# EAGLE design Board (EAGLE 6.5.0)
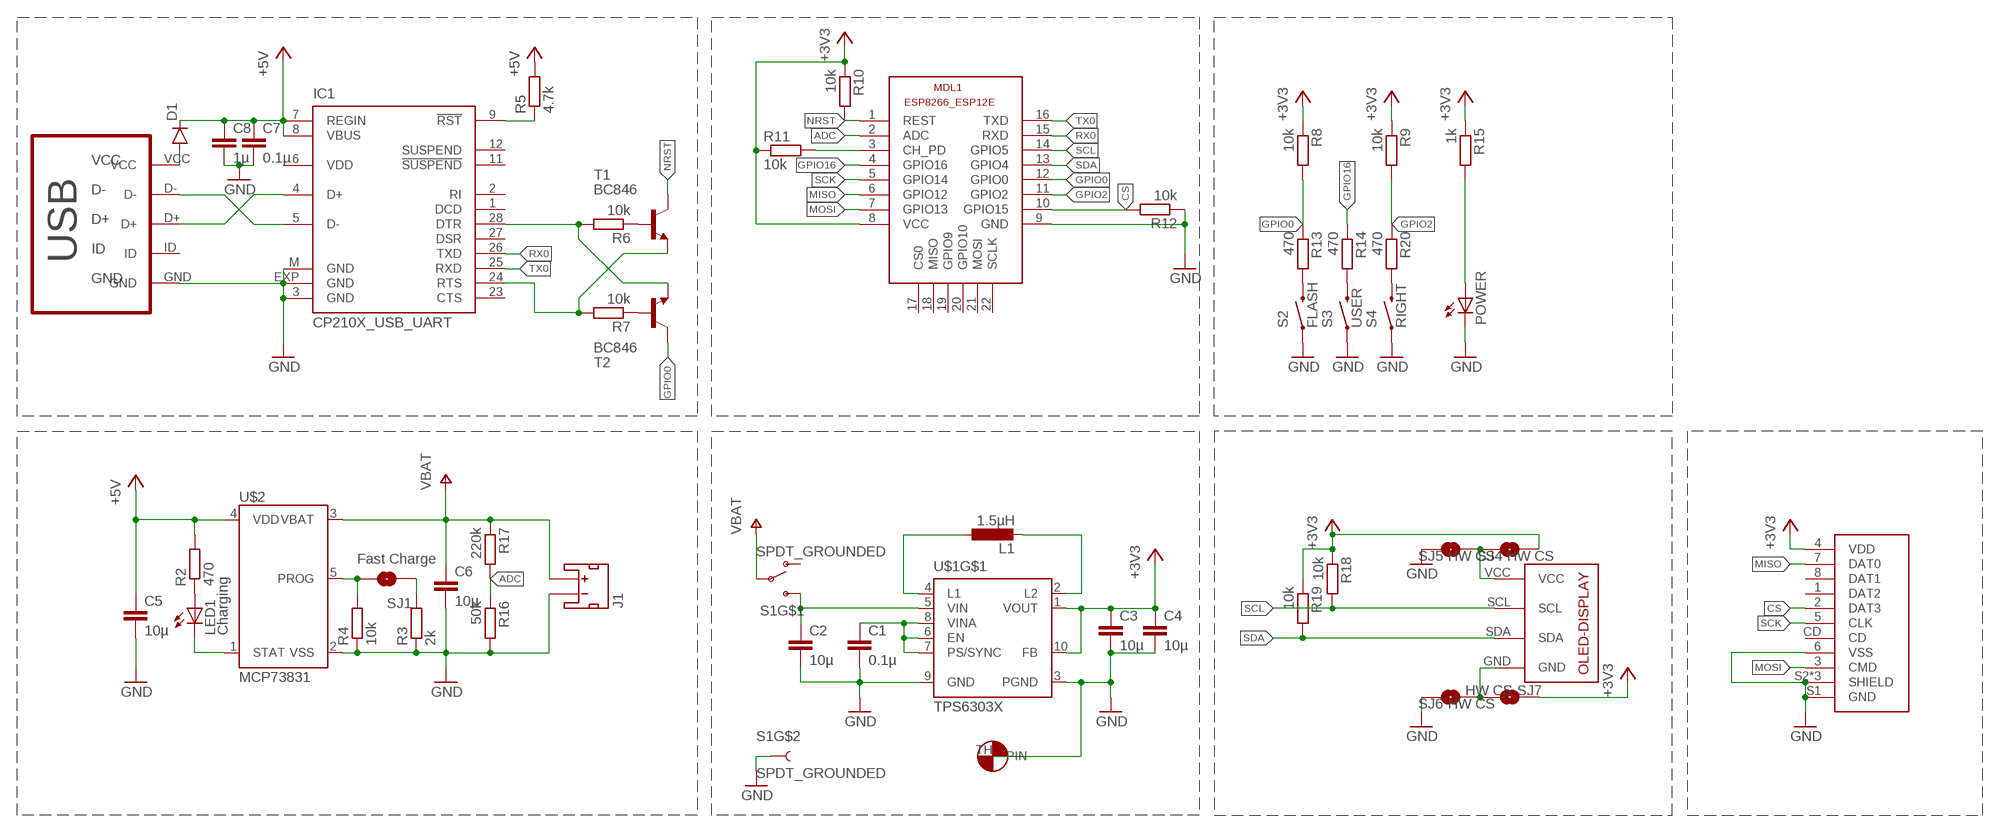
[diagram p0: schematic, sheet 1]

## Parts
C1  0.1µ  C-EUC0603  [C0603]
C2  10µ  C-EUC0603  [C0603]
C3  10µ  C-EUC0603  [C0603]
C4  10µ  C-EUC0603  [C0603]
C5  10µ  C-EUC0603  [C0603]
C6  10µ  C-EUC0603  [C0603]
C7  0.1µ  C-EUC0603  [C0603]
C8  1µ  C-EUC0603  [C0603]
D1  DIODEBAS16  [SOD-323]
IC1  CP210X_USB_UART  [MLP28]
J1  JST_2MM_MALE  [JST-2-SMD]
L1  1.5µH  L-EUL3225P  [L3225P]
LED1  Charging  LEDSML0805  [SML0805]
MDL1  ESP8266-12EESP8266-ESP12E  [ESP8266-ESP12E]
POWER  LEDSML0805  [SML0805]
R2  470  R-EU_R0603  [R0603]
R3  2k  R-EU_R0603  [R0603]
R4  10k  R-EU_R0603  [R0603]
R5  4.7k  R-EU_R0603  [R0603]
R6  10k  R-EU_R0603  [R0603]
R7  10k  R-EU_R0603  [R0603]
R8  10k  R-EU_R0603  [R0603]
R9  10k  R-EU_R0603  [R0603]
R10  10k  R-EU_R0603  [R0603]
R11  10k  R-EU_R0603  [R0603]
R12  10k  R-EU_R0603  [R0603]
R13  470  R-EU_R0603  [R0603]
R14  470  R-EU_R0603  [R0603]
R15  1k  R-EU_R0603  [R0603]
R16  50k  R-EU_R0603  [R0603]
R17  220k  R-EU_R0603  [R0603]
R18  10k  R-EU_R0603  [R0603]
R19  10k  R-EU_R0603  [R0603]
R20  470  R-EU_R0603  [R0603]
S1  SPDT_GROUNDED  [SWITCH-SPST-SMD-A]
S2  FLASH  SWITCH-MOMENTARY-2SMD-1101NE  [TACTILE-SWITCH-1101NE]
S3  USER  SWITCH-MOMENTARY-2SMD-1101NE  [TACTILE-SWITCH-1101NE]
S4  RIGHT  SWITCH-MOMENTARY-2SMD-1101NE  [TACTILE-SWITCH-1101NE]
SJ1  Fast Charge  SOLDERJUMPERNO  [SJ_2S-NO]
SJ4  HW CS  SOLDERJUMPERNO  [SJ_2S-NO]
SJ5  HW CS  SOLDERJUMPERNO  [SJ_2S-NO]
SJ6  HW CS  SOLDERJUMPERNO  [SJ_2S-NO]
SJ7  HW CS  SOLDERJUMPERNO  [SJ_2S-NO]
T1  BC846  [SOT23]
T2  BC846  [SOT23]
U$1  TPS6303X  [DSK10]
U$2  MCP73831  [SOT23-5]
U$3  MICRO-USB-B  [MICRO_USB_4_LEGS]
U$4  MICRO_SD_SOCKET  [MICRO_SD]
U$6  OLED-I2C  [OLED-I2C]

## Nets
+3V3: C3.1 C4.1 MDL1.8(VCC) R8.1 R9.1 R10.1 R11.1 R15.1 R18.1 R19.1 SJ4.1 SJ7.2 U$1.1(VOUT) U$1.10(FB) U$4.4(VDD)
+5V: C5.1 C7.1 C8.1 D1.C IC1.7(REGIN) IC1.8(VBUS) R2.2 R5.2 U$2.4(VDD)
ADC: MDL1.2(ADC) R16.1 R17.2
CS: MDL1.10(GPIO15) R12.2 U$4.2(DAT3)
GND: C1.2 C2.2 C3.2 C4.2 C5.2 C6.2 C7.2 C8.2 IC1.3(GND) IC1.EXP(GND) IC1.M(GND) J1.1(-) MDL1.9(GND) POWER.C R3.1 R4.1 R12.1 R16.2 S1.GND1 S1.GND2 S1.GND3 S1.GND4 S2.1 S3.1 S4.1 SJ5.2 SJ6.2 U$1.3(PGND) U$1.9(GND) U$1.TH(THREMAL:PIN) U$2.2(VSS) U$3.GND U$4.6(VSS) U$4.S1(GND) U$4.S2(SHIELD) U$4.S3(SHIELD) U$4.S4(SHIELD)
GPIO0: MDL1.12(GPIO0) R8.2 R13.1 T2.3(C)
GPIO2: MDL1.11(GPIO2) R9.2 R20.1
GPIO16: MDL1.4(GPIO16) R14.1
MISO: MDL1.6(GPIO12) U$4.7(DAT0)
MOSI: MDL1.7(GPIO13) U$4.3(CMD)
N$1: L1.1 U$1.4(L1)
N$2: L1.2 U$1.2(L2)
N$3: IC1.9(!RST) R5.1
N$4: D1.A U$3.VCC
N$5: IC1.5(D-) U$3.D-
N$6: C1.1 U$1.6(EN) U$1.7(PS/SYNC) U$1.8(VINA)
N$7: LED1.A R2.1
N$8: R4.2 SJ1.1 U$2.5(PROG)
N$10: LED1.C U$2.1(STAT)
N$12: R3.2 SJ1.2
N$13: MDL1.3(CH_PD) R11.2
N$14: IC1.4(D+) U$3.D+
N$15: IC1.28(DTR) R6.2 T2.2(E)
N$16: R7.1 T2.1(B)
N$17: C2.1 S1.3(S) U$1.5(VIN)
N$18: R6.1 T1.1(B)
N$19: IC1.24(RTS) R7.2 T1.2(E)
N$21: R14.2 S3.2
N$22: R13.2 S2.2
N$24: POWER.A R15.2
N$26: SJ4.2 SJ5.1 U$6.VCC
N$28: SJ6.1 SJ7.1 U$6.GND
N$29: R20.2 S4.2
NRST: MDL1.1(REST) R10.2 T1.3(C)
RX0: IC1.26(TXD) MDL1.15(RXD)
SCK: MDL1.5(GPIO14) U$4.5(CLK)
SCL: MDL1.14(GPIO5) R18.2 U$6.SCL
SDA: MDL1.13(GPIO4) R19.2 U$6.SDA
TX0: IC1.25(RXD) MDL1.16(TXD)
V+: C6.1 J1.2(+) R17.1 S1.2(P) U$2.3(VBAT) ; supply symbol labelled VBAT
Unconnected: IC1.1(DCD) IC1.2(RI) IC1.11(!SUSPEND) IC1.12(SUSPEND) IC1.23(CTS) IC1.27(DSR) J1.NC1(PAD1) J1.NC2(PAD2) MDL1.17(CS0) MDL1.18(MISO) MDL1.19(GPIO9) MDL1.20(GPIO10) MDL1.21(MOSI) MDL1.22(SCLK) S1.1(O) U$3.ID U$4.1(DAT2) U$4.8(DAT1) U$4.CD

## Power pins joined to a net without a drawn wire
VDD: IC1.6(VDD)

## Library data of the parts
C1-C8 = rcl:C-EU: CAPACITOR, European symbol
D1 = SparkFun-DiscreteSemi:DIODE: Diode These are standard reverse protection diodes and small signal diodes. SMA package can handle up to about 1A. SOD-323 can handle about 200mA. What the SOD-323 package when ordering, there are some mfgs out there that are 5-pin packages.; PROD_ID: DIO-09646; VALUE: 250mA/100V
IC1 = SparkFun-DigitalIC:CP210X_USB_UART: Single-Chip USB to UART Bridge Source: www.silabs.com .. CP2101.pdf / cp2102.pdf. Spark Fun Electronics SKU : COM-00310
J1 = SparkFun-Connectors:JST_2MM_MALE: Mates to single-cell LiPo batteries. CONN-11443 Now with smashable polarity marks!; BTM_NEG: -; BTM_POS: +; PROD_ID: CONN-11443; TOP_NEG: -; TOP_POS: +
L1 = rcl:L-EU: INDUCTOR, European symbol
LED1 POWER = led:LED: LED OSRAM: - CHIPLED LG R971, LG N971, LY N971, LG Q971, LY Q971, LO R971, LY R971 LH N974, LH R974 LS Q976, LO Q976, LY Q976 LO Q996 - Hyper CHIPLED LW Q18S LB Q993, LB Q99A, LB R99A - SideLED LS A670, LO A670, LY A670, LG A670, LP A670 LB A673, LV A673, LT A673, LW A673 LH A674 LY A675 LS A676, LA A676, LO A676, LY A676, LW A676 LS A679, LY A679, LG A679 - Hyper Micro SIDELED® LS Y876, LA Y876, LO Y876, LY Y876 LT Y87S - SmartLED LW L88C, LW L88S LB L89C, LB L89S, LG L890 LS L89K, LO L89K, LY L89K LS L896, LA L896, LO L896, LY L896 - TOPLED LS T670, LO T670, LY T670, LG T670, LP T670 LSG T670, LSP T670, LSY T670, LOP T670, LYG T670 LG T671, LOG T671, LSG T671 LB T673, LV T673, LT T673, LW T673 LH T674 LS T676, LA T676, LO T676, LY T676, LB T676, LH T676, LSB T676, LW T676 LB T67C, LV T67C, LT T67C, LS T67K, LO T67K, LY T67K, LW E67C LS E67B, LA E67B, LO E67B, LY E67B, LB E67C, LV E67C, LT E67C LW T67C LS T679, LY T679, LG T679 LS T770, LO T770, LY T770, LG T770, LP T770 LB T773, LV T773, LT T773, LW T773 LH T774 LS E675, LA E675, LY E675, LS T675 LS T776, LA T776, LO T776, LY T776, LB T776 LHGB T686 LT T68C, LB T68C - Hyper Mini TOPLED® LB M676 - Mini TOPLED Santana® LG M470 LS M47K, LO M47K, LY M47K Source: http://www.osram.convergy.de LUXEON: - LUMILED® LXK2-PW12-R00, LXK2-PW12-S00, LXK2-PW14-U00, LXK2-PW14-V00 LXK2-PM12-R00, LXK2-PM12-S00, LXK2-PM14-U00 LXK2-PE12-Q00, LXK2-PE12-R00, LXK2-PE12-S00, LXK2-PE14-T00, LXK2-PE14-U00 LXK2-PB12-K00, LXK2-PB12-L00, LXK2-PB12-M00, LXK2-PB14-N00, LXK2-PB14-P00, LXK2-PB14-Q00 LXK2-PR12-L00, LXK2-PR12-M00, LXK2-PR14-Q00, LXK2-PR14-R00 LXK2-PD12-Q00, LXK2-PD12-R00, LXK2-PD12-S00 LXK2-PH12-R00, LXK2-PH12-S00 LXK2-PL12-P00, LXK2-PL12-Q00, LXK2-PL12-R00 Source: www.luxeon.com KINGBRIGHT: KA-3528ASYC Source: www.kingbright.com
MDL1 = ESP8266-ESP12E:ESP8266-12E: ESP8266-12E with additional I/O and GPIO04/05 corrected The author cannot warrant that this library is free from error or will meet your specific requirements. Created by PuceBaboon.com. Komagane, Nagano, JAPAN
R2-R20 = rcl:R-EU_: RESISTOR, European symbol
S1 = SparkFun-Electromechanical:SPDT_GROUNDED
S2-S4 = SparkFun-Electromechanical:SWITCH-MOMENTARY-2: Various NO switches- pushbuttons, reed, etc; PROD_ID: SWCH-00815
SJ1 SJ4-SJ7 = SparkFun-Retired:SOLDERJUMPER: Solder Jumper Standard SMD solder jumper. Used to automate production. Two varients : Normally Open and Normally Closed are the same, but have different paste layers. NC will have a large amount of paste and should jumper during reflow.
T1 T2 = transistor:BC846: NPN TRANSISTOR
U$1 = OwnStuff:TPS6303X
U$2 = GeekAmmo:MCP73831: MCP73831 Miniature Single-Cell, Fully Integrated Li-Ion, Li-Polymer Charge Management Controllers The MCP73831/2 devices are highly advanced linear charge management controllers for use in spacelimited, cost-sensitive applications. http://ww1.microchip.com/downloads/en/DeviceDoc/20001984F.pdf
U$3 = micro usb B - 4LEGS:MICRO-USB-B
U$4 = OwnStuff:MICRO_SD_SOCKET
U$6 = OwnStuff:OLED-I2C

## Board
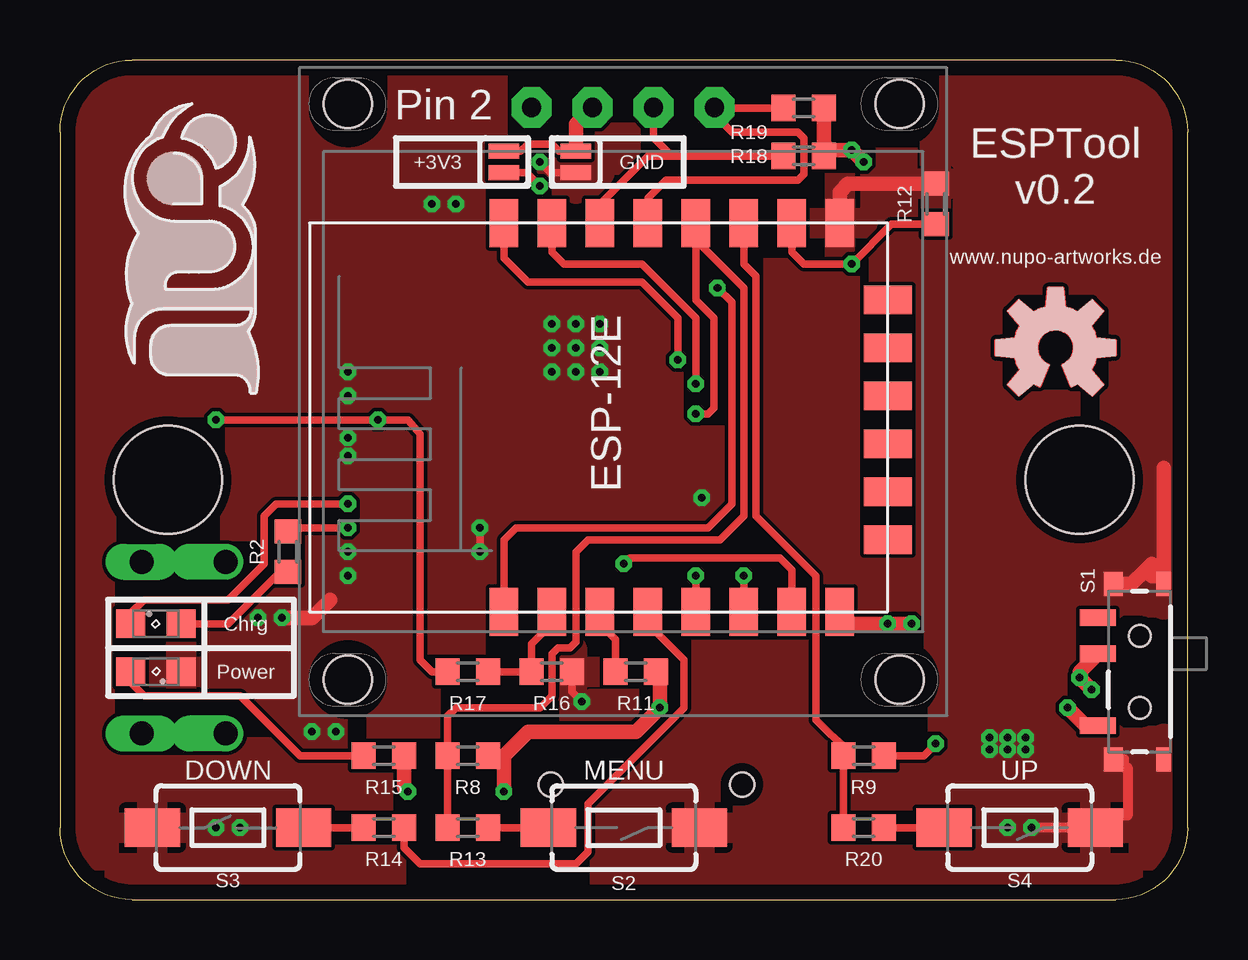
[diagram p1: board, top side]
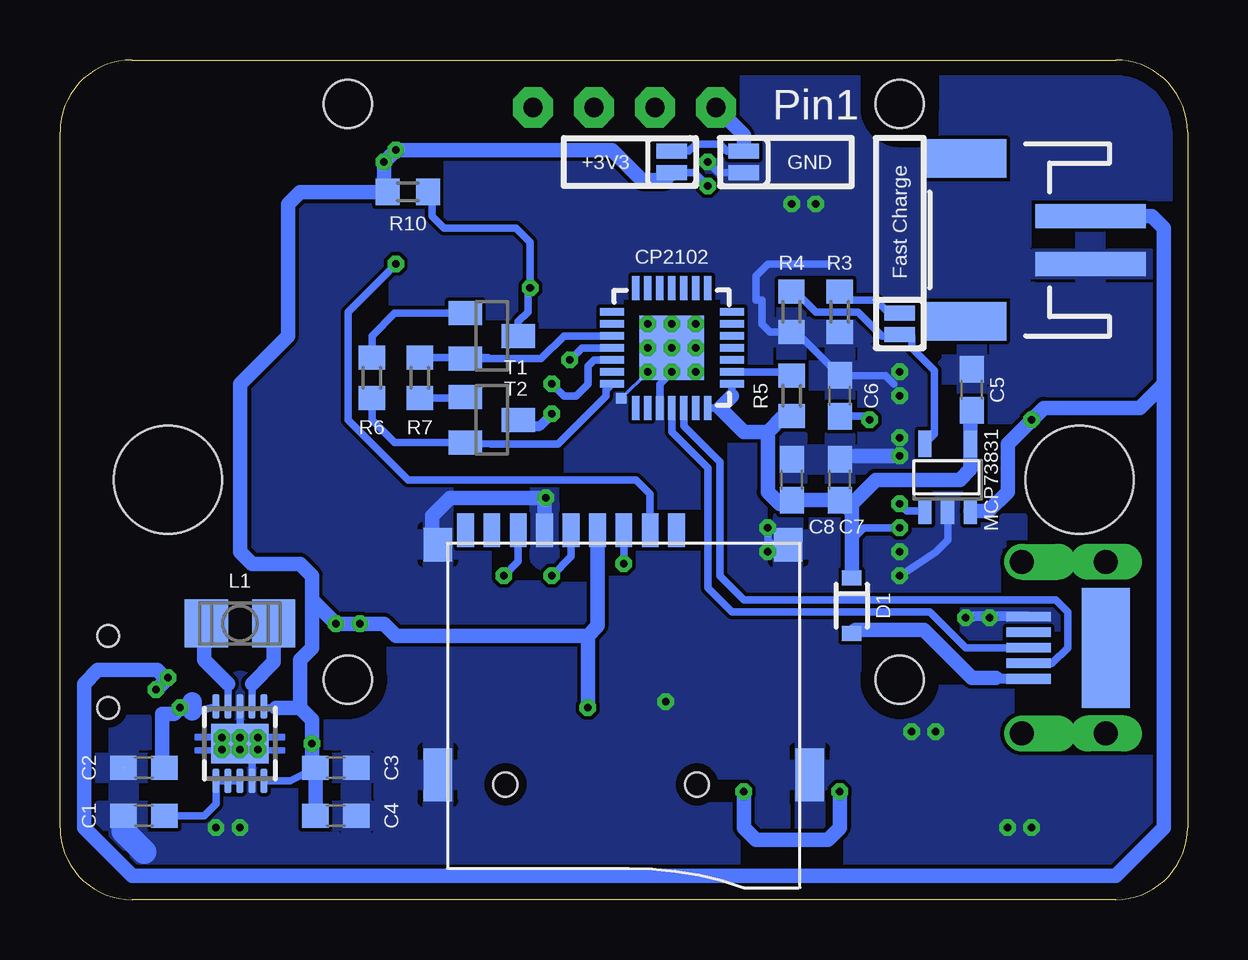
[diagram p2: board, bottom side, seen from below]

Size 47 x 35 mm. Coordinates in mm from the lower left corner, seen from the top.
Outline: 0,32 0,3 arc90 3,0 44,0 arc90 47,3 47,32 arc90 44,35 3,35 arc90 0,32
Copper layers (1*16): Top 0.0356mm / dielectric 1.5011mm / Bottom 0.0356mm
Design rules "oshpark-2layer *": minimum track width 6mil, minimum drill 13mil, track to track 6mil, track to pad 6mil, pad to pad 6mil, via to via 6mil, smd to smd 0mil, copper to edge 15mil, drill to drill 6mil, minimum pad ring 7mil, minimum via ring 7mil, stop-mask expansion 2.5mil, vias tented up to drill 24mil, thermal gap 10mil
Holes 4.5 mm at 4.5,17.5 42.5,17.5
Holes 2 mm at 12,33.17 35,33.17 12,9.18 35,9.18
tKeepout: area 40.3,15.3 to 44.7,19.7; area 2.3,15.3 to 6.7,19.7; area 11,8.2 to 13,10.2; area 34,8.2 to 36,10.2; 20 lines
bKeepout: area 2.3,15.3 to 6.7,19.7; area 40.3,15.3 to 44.7,19.7; area 40.3,15.3 to 44.7,19.7; area 2.3,15.3 to 6.7,19.7; area 11,8.2 to 13,10.2; area 34,8.2 to 36,10.2; 20 lines
tRestrict: area 2.3,15.3 to 6.7,19.7; area 40.3,15.3 to 44.7,19.7; area 11,8.2 to 13,10.2; area 34,8.2 to 36,10.2; 20 lines
bRestrict: area 11,8.2 to 13,10.2; area 34,8.2 to 36,10.2; area 2.3,15.3 to 6.7,19.7; area 40.3,15.3 to 44.7,19.7; area 19.5,21 to 20.2,25; area 19.5,21 to 23.5,21.8; area 22.8,21 to 23.5,25; area 19.5,24.2 to 23.5,25; 22 lines

### Footprints (pad centres in the part's own frame; a part is rotated, then mirrored left to right if it is on the bottom)
C0603 = smd 1.1 x 1: 1 -0.85,0; 2 0.85,0
SOD-323 = smd 0.63 x 0.83: A 1.15,0; C -1.15,0
MLP28 = smd 1 x 0.3: 1 -2.5,1.5; 2 -2.5,1; 3 -2.5,0.5; 4 -2.5,0; 5 -2.5,-0.5; 6 -2.5,-1; 7 -2.5,-1.5; 15 2.5,-1.5; 16 2.5,-1; 17 2.5,-0.5; 18 2.5,0; 19 2.5,0.5; 20 2.5,1; 21 2.5,1.5 | smd 0.3 x 1: 8 -1.5,-2.5; 9 -1,-2.5; 10 -0.5,-2.5; 11 0,-2.5; 12 0.5,-2.5; 13 1,-2.5; 14 1.5,-2.5; 22 1.5,2.5; 23 1,2.5; 24 0.5,2.5; 25 0,2.5; 26 -0.5,2.5; 27 -1,2.5; 28 -1.5,2.5 | smd 2.7 x 2.7: EXP 0,0 | smd 0.435 x 0.435: M -2.103,2.103
JST-2-SMD = smd 1 x 4.6: 1 -1,-3.7; 2 1,-3.7 | smd 1.6 x 3.4: NC1 -3.4,1.5; NC2 3.4,1.5
L3225P = smd 1.8 x 2: 1 -1.4,0; 2 1.4,0
SML0805 = smd 1.2 x 1.2: A 1.05,0; C -1.05,0
ESP8266-ESP12E = smd 2 x 1.2: 1 0,16; 2 0,14; 3 0,12; 4 0,10; 5 0,8; 6 0,6; 7 0,4; 8 0,2; 9 16.2,2; 10 16.2,4; 11 16.2,6; 12 16.2,8; 13 16.2,10; 14 16.2,12; 15 16.2,14; 16 16.2,16 | smd 1.2 x 2: 17 11,0; 18 3,0; 19 5,0; 20 13,0; 21 7,0; 22 9,0
R0603 = smd 1 x 1.1: 1 -0.85,0; 2 0.85,0
SWITCH-SPST-SMD-A = smd 0.7 x 1.5: 1 -2.25,-1.75; 2 -0.75,-1.75; 3 2.25,-1.75 | smd 1 x 0.6: GND1 -3.65,1; GND3 3.65,1 | smd 1 x 0.8: GND2 -3.65,-1.1; GND4 3.65,-1.1 | hole 0.9: -1.5,0; 1.5,0
TACTILE-SWITCH-1101NE = smd 2.3 x 1.6: 1 -3.15,0; 2 3.15,0
SJ_2S-NO = smd 0.635 x 1.27: 1 -0.45,0; 2 0.45,0
SOT23 = smd 1 x 1.4: 1 -0.95,-1.1; 2 0.95,-1.1; 3 0,1.1
DSK10 = smd 0.28 x 1: 1 -1,-1.55; 2 -0.5,-1.55; 3 0,-1.55; 4 0.5,-1.55; 5 1,-1.55; 6 1,1.55; 7 0.5,1.55; 8 0,1.55; 9 -0.5,1.55; 10 -1,1.55 | smd 2.4 x 1.65: TH 0,0
SOT23-5 = smd 0.55 x 1.1: 1 -0.95,-1.3; 2 0,-1.3; 3 0.95,-1.3; 4 0.95,1.5; 5 -0.95,1.5
MICRO_USB_4_LEGS = smd 1.85 x 0.4: D+ 3.125,0; D- 3.125,0.65; GND 3.125,-1.3; ID 3.125,-0.65; VCC 3.125,1.3 | drill 1 pad 1.397 long: P$1 -0.1,3.575; P$2 -0.1,-3.575 | drill 1 pad 1.397 offset: P$3 3.4,3.575; P$5 3.4,-3.575 | smd 2 x 5: P$4 -0.1,0
MICRO_SD = smd 0.7 x 1.4: 1 2.2,5.65; 2 1.1,5.65; 3 0,5.65; 4 -1.1,5.65; 5 -2.2,5.65; 6 -3.3,5.65; 7 -4.4,5.65; 8 -5.5,5.65; CD -6.6,5.65 | smd 1.2 x 1.4: S1 -7.75,5.05; S3 6.85,5.05 | smd 1.2 x 2.2: S2 -7.75,-4.55; S4 7.75,-4.55 | hole 1: -4.93,-4.95; 3.05,-4.95
OLED-I2C = drill 0.8 pad 1.676 octagon: GND -1.27,11.85; SCL 1.27,11.85; SDA 3.81,11.85; VCC -3.81,11.85

### Placement (x,y rotation side)
C1  43.5,3.5 180 bottom
C2  43.5,5.5 180 bottom
C3  35.5,5.5 0 bottom
C4  35.5,3.5 0 bottom
C5  9,21.25 90 bottom
C6  14.5,21 90 bottom
C7  14.5,17.5 90 bottom
C8  16.5,17.5 90 bottom
D1  14,12.25 270 bottom
IC1  21.5,23 90 bottom
J1  7.75,27.5 90 bottom
L1  39.5,11.51 0 bottom
LED1  4,11.5 0 top
MDL1  34.5,12 90 top
POWER  4,9.5 180 top
R2  9.5,14.5 90 top
R3  14.5,24.5 90 bottom
R4  16.51,24.5 90 bottom
R5  16.5,21 270 bottom
R6  34,21.75 270 bottom
R7  32,21.75 90 bottom
R8  17,6 180 top
R9  33.5,6 180 top
R10  32.5,29.5 0 bottom
R11  24,9.5 180 top
R12  36.5,29 270 top
R13  17,3 0 top
R14  13.5,3 180 top
R15  13.5,6 180 top
R16  20.5,9.5 0 top
R17  17,9.5 0 top
R18  31,31 180 top
R19  31,33 180 top
R20  33.5,3 0 top
S1  45,9.5 270 top
S2  23.5,3 180 top
S3  7,3 0 top
S4  40,3 180 top
SJ1  12,24 90 bottom
SJ4  21.5,30.75 90 bottom
SJ5  18.5,30.75 270 bottom
SJ6  21.5,30.75 270 top
SJ7  18.5,30.75 270 top
T1  29,23.5 270 bottom
T2  29,20 270 bottom
U$1  39.5,6.5 180 bottom
U$2  10,17.5 0 bottom
U$3  3.5,10.5 180 bottom
U$4  23.5,9.75 0 bottom
U$5  [LOGO-SILKSCREEN]  6.5,27 90 top
U$6  23.47,21.17 0 top
U$7  [OSHW-LOGO-M]  41.5,23 0 top
U$8  [OSHW-LOGO-M_COPPER]  41.5,23 0 top

### Tracks (layer width: path | path; a pad name or v marks a point on that pad's centre or on a via)
+3V3  (via drill 0.33)
  Top 0.305: R11.1 24.85,9.15 25,9 | SJ7.2 19.45,30.3 v20,29.75 | 18,6.15 R8.1 | R9.1 36,6 v36.5,6.5
  Top 0.61: v35.5,11.5 v34.5,11.5 33,11.5 MDL1.8 | R19.1 31.85,31.5 | 31.85,31.5 R18.1 | v33.5,30.75 v33,31.25 32.1,31.25 31.85,31.5 | 25,9 v25,8 24,7 19.5,7 18.5,6 18.5,5.85 | 18.5,5.85 R8.1 | R15.1 14.35,4.65 v14.5,4.5 | v18.5,4.5 18.5,5.85
  Bottom 0.305: U$1.10 37.4,4.95 C3.1 | 38,8 38.45,8 U$1.1 | SJ4.1 20.55,30.3 v20,29.75
  Bottom 0.61: 37,8 36.5,7.5 v36.5,6.5 36.5,5.65 C3.1 C4.1 | 36.5,12.5 v35.5,11.5 v34.5,11.5 33.5,11.5 33,11 25,11 | 37,8 38,8 | 36.5,12.5 36.5,13.5 37,14 39,14 39.5,14.5 39.5,21.5 37.5,23.5 37.5,29 37,29.5 R10.1 33.5,29.65 v33.5,30.75 v33,31.25 24,31.25 22.75,30 21.8,30 SJ4.1 | U$4.4 24.6,11.4 25,11 | 36.5,12.5 36.5,10.5 37,10 37,8 | 25,11 v25,8 | v14.5,4.5 14.5,3 15,2.5 18,2.5 18.5,3 v18.5,4.5
+5V  (via drill 0.33)
  Top 0.305: v12,15.5 9.65,15.5 R2.2
  Bottom 0.305: 19,21 IC1.8 | IC1.7 19.5,20.5 | v12,15.5 13.5,15.5 14,15
  Bottom 0.61: 14,16.15 C7.1 C8.1 16.65,16.5 17,16.5 17.5,17 17.5,19.5 | R5.2 16.85,20.15 17.5,19.5 | 17.5,19.5 18.5,19.5 19.5,20.5 19,21 | 14,16.15 14,16.5 13,17.5 9.5,17.5 9.05,17.95 U$2.4 9.05,20.35 C5.1 | D1.C 14,15 14,16.15
ADC
  Top 0.305: R17.2 R16.1 19.65,10.65 20.5,11.5 MDL1.2 20.15,11.65
CS  (via drill 0.33)
  Top 0.305: R12.2 34.65,28.15 v33,26.5 31,26.5 30.5,27 MDL1.10
  Bottom 0.305: U$4.2 22.4,16.9 23,17.5 32.5,17.5 35,20 35,24.5 v33,26.5
GND  (via drill 0.33)  (1 unrouted)
  Top 0.305: v17.5,14.5 v17.5,15.5 | SJ6.2 20.45,30.3 v20,30.75 | R16.2 21.35,8.65 v21.75,8.25
  Top 0.406: S1.GND4 44.35,5.85 C2.2 44.5,5.5 44.5,3.5 44,3.5 44,3 v40.5,3
  Top 0.61: R12.1 32.85,29.85 32.5,29.5 MDL1.9 | 11.25,12.5 10.5,11.75 v9.25,11.75 | S1.GND2 44.65,13.15 45.25,13.75 | 45.25,13.75 45.5,14 | 46,18 46,13.5 45.5,13.5 45.25,13.75
  Bottom 0.152: IC1.M v22.5,22
  Bottom 0.305: 12.25,21.5 12.6,21.85 C6.2 16.3,23.65 R4.1 17.4,23.65 17.75,24 17.75,25 18,25 18,26 17.5,26.5 15,26.5 | 14.25,18.5 14.4,18.25 C7.2 | U$1.9 39,5.75 v38.75,6.25 | U$1.3 v39.5,6.75 | U$4.S3 17.05,14.55 17.5,15 | 17.5,15 v17.5,15.5 v17.5,14.5 17.5,15 | IC1.3 22,21.5 v21.5,22 | SJ5.2 19.55,30.3 v20,30.75 | U$2.2 10,15 10.5,14.5 v12,13.5
  Bottom 0.406: U$3.GND 8.95,11.8 v9.25,11.75
  Bottom 0.61: 14.35,18.5 C7.2 | U$4.S1 31.5,15.05 31.5,16 30.75,16.75 v26.75,16.75 26.8,16.7 U$4.6 | 14.25,18.5 v12,18.5
  Bottom 1.016: C1.2 44.35,2.85 43.5,2
  other vias: 15.5,29 38.75,6.75 40.25,6.75 39.5,6.25 40.25,6.25 8.25,11.75 21.5,23 20.5,24 21.5,24 20.5,23 22.5,23 20.5,22 12,19.25 39.5,3 6.5,3 7.5,3 12,22 12,21 12,14.5 22.5,24 16.5,29 10.5,7 11.5,7
  pour Top: 0,32 arc-90 3,35 44,35 arc-90 47,32 47,3 arc-90 44,0 3,0 arc-90 0,3
  pour Bottom: 0,32 arc-90 3,35 44,35 arc-90 47,32 47,3 arc-90 44,0 3,0 arc-90 0,3
GPIO0  (via drill 0.33)
  Top 0.305: 26.5,27.5 26.5,25 27.25,24.25 27.25,20.5 27,20.25 v26.5,20.25 | 26.5,27.5 MDL1.12 | 16.15,3.9 R13.1 R8.2 16.15,7.65 16.5,8 20,8 20.5,8.5 20.5,10.25 20.75,10.5 21.25,10.5 21.5,10.75 21.5,14.5 22,15 27.5,15 28.5,16 28.5,25.5 26.5,27.5
  Bottom 0.305: 27.65,19.75 T2.3
  Bottom 0.406: 27.65,19.75 27,19.75 v26.5,20.25
GPIO2
  Top 0.305: R20.1 R9.2 32.65,6.4 32.1,6.9 31.5,7.5 31.5,13.5 29,16 29,26 28.5,26.5 MDL1.11
GPIO16
  Top 0.305: R14.1 14.35,2.15 15,1.5 21.5,1.5 22,2 22,4 26,8 26,10 24.5,11.5 MDL1.4
MISO  (via drill 0.33)
  Top 0.305: v28.5,13.5 MDL1.6
  Bottom 0.305: U$4.7 27.9,14.1 v28.5,13.5
MOSI  (via drill 0.33)
  Top 0.305: MDL1.7 30.5,13.75 30,14.25 23.75,14.25 v23.5,14
  Bottom 0.305: v23.5,14 U$4.3
N$1
  Bottom 0.305: U$1.4 40,9
  Bottom 0.61: 40,9 41,10 41,11.41 L1.1
N$2
  Bottom 0.305: 39,9 U$1.2
  Bottom 0.61: L1.2 38.1,9.9 39,9
N$3
  Bottom 0.305: IC1.9 16.65,22 R5.1
N$4
  Bottom 0.305: U$3.VCC 7.2,9.2
  Bottom 0.406: 7.2,9.2 7.95,9.2 8,9.25
  Bottom 0.61: 8,9.25 9,9.25 11,11.25 13.85,11.25 D1.A
N$5
  Bottom 0.305: IC1.5 21,19.75 19.5,18.25 19.5,13.5 18.5,12.5 5.5,12.5 5,12 5,10.5 5.65,9.85 U$3.D-
N$6
  Bottom 0.305: C1.1 41,3.5 40.5,4 U$1.6 U$1.7 U$1.8
N$7
  Top 0.305: LED1.A 7,11.5 9,13.5 9.35,13.5
  Top 0.406: 9.35,13.5 R2.1
N$8
  Bottom 0.305: U$2.5 10.55,19.4 10.55,22.05 11.5,23 11.5,23.5 11.95,23.5 SJ1.1 12.05,23.5 12.75,23.5 13.75,24.5 15.5,24.5 16.35,25.35 R4.2
N$10  (via drill 0.33)
  Top 0.305: v12,16.5 9,16.5 8.5,16 8.5,14 7,12.5 3.5,12.5 2.95,11.95 LED1.C
  Bottom 0.305: U$2.1 11.7,16.2 v12,16.5
N$12
  Bottom 0.305: SJ1.2 12.45,24.45 13,25 14.15,25 R3.2
N$13
  Top 0.305: R11.2 23.15,10.85 22.5,11.5 MDL1.3
N$14
  Bottom 0.305: IC1.4 21.5,19.5 20,18 20,13 19,12 10.75,12 9.25,10.5 U$3.D+
N$15
  Bottom 0.305: R6.2 34,20 33.05,19.05 T2.2 29.05,19 26.25,19 24.25,21 24.25,21.25 IC1.28
N$16
  Bottom 0.305: R7.1 30.1,20.9 T2.1
N$17  (via drill 0.33)
  Top 0.61: 42.25,7.75 v42,8 42.75,7.25 S1.3
  Bottom 0.305: 41.5,7.88 41.17,7.88 U$1.5
  Bottom 0.61: C2.1 42.75,5.6 42.75,7.75 42.25,7.75 v42,8 41.75,8 41.5,8.25
  Bottom 0.813: 41.5,8.25 41.5,7.88
N$18
  Bottom 0.305: T1.1 33.05,24.45 34,23.5 R6.1
N$19
  Bottom 0.305: R7.2 29.15,22.6 T1.2 26.95,22.55 26,23.5 IC1.24
N$21
  Top 0.305: S3.2 R14.2
N$22
  Top 0.305: S2.2 R13.2
N$24
  Top 0.305: POWER.A 2.95,9.05 3.5,8.5 7.5,8.5 10,6 R15.2
N$26
  Bottom 0.305: SJ4.2 20.8,31.2 20.5,31.5 19.5,31.5 19.2,31.2 SJ5.1
  Bottom 0.61: SJ5.1 18.5,31.86 U$6.VCC
N$28
  Top 0.305: SJ7.1 19.2,31.2 19.5,31.5 20.5,31.5 20.8,31.2 SJ6.1
  Top 0.61: SJ6.1 21.5,32.32 U$6.GND
N$29
  Top 0.305: S4.2 R20.2
NRST  (via drill 0.33)
  Top 0.305: MDL1.1 18.5,15 19,15.5 27,15.5 28,16.5 28,24.9 v27.4,25.5
  Bottom 0.305: R10.2 31.5,29.35 31.5,28.5 31,28 28,28 27.4,27.4 v27.4,25.5 27.5,25.4 27.5,24.5 27.9,24.1 T1.3
RX0  (via drill 0.33)
  Top 0.305: MDL1.15 20.5,27 21,26.5 24.25,26.5 26.5,24.25 v26.5,21.5
  Bottom 0.305: v26.5,21.5 26,21 25.5,21 25,21.5 25,22.25 24.75,22.5 IC1.26
SCK  (via drill 0.33)
  Top 0.305: v26.5,13.5 MDL1.5
  Bottom 0.305: U$4.5 25.7,14.3 v26.5,13.5
SCL
  Top 0.305: U$6.SCL 24.74,31.76 25.5,31 | 25.5,31 R18.2 | 25.5,31 24.5,31 22.5,29 MDL1.14
SDA
  Top 0.305: R19.2 27.3,33 U$6.SDA 27.28,32.72 28,32 30.75,32 31,31.75 31,30.25 30.75,30 25.25,30 24.5,29.25 MDL1.13
TX0  (via drill 0.33)
  Top 0.305: MDL1.16 18.5,26.75 19.5,25.75 24.25,25.75 25.75,24.25 v25.75,22.5
  Bottom 0.305: v25.75,22.5 25.25,23 IC1.25
V+  (via drill 0.33)
  Top 0.305: v6.5,20 v13.25,20 14.5,20 15,19.4 15,10 15.5,9.5 R17.1
  Top 0.61: v43,8.75 v42.5,9.25 42.5,9.5 S1.2
  Bottom 0.305: C6.1 13.15,20.15 v13.25,20
  Bottom 0.61: J1.2 1.5,28.5 1,28 1,21.5 | 1,21.5 1,3 3,1 44,1 46,3 46,9 45.42,9.58 42.94,9.58 42.61,9.25 v42.5,9.25 v43,8.75 | U$2.3 8.3,16.2 7.5,17 7.5,19 v6.5,20 6,20.5 2,20.5 1,21.5

### Text on the board
bPlace: Pin1 | GND | +3V3
tNames: Pin 2 | +3V3 | GND | ESPTool / v0.2 | www.nupo-artworks.de | Chrg | Power | DOWN | MENU | UP
bNames: Fast Charge | CP2102 | MCP73831